# EAGLE design arduino_pro_mini (EAGLE 8.3.1)
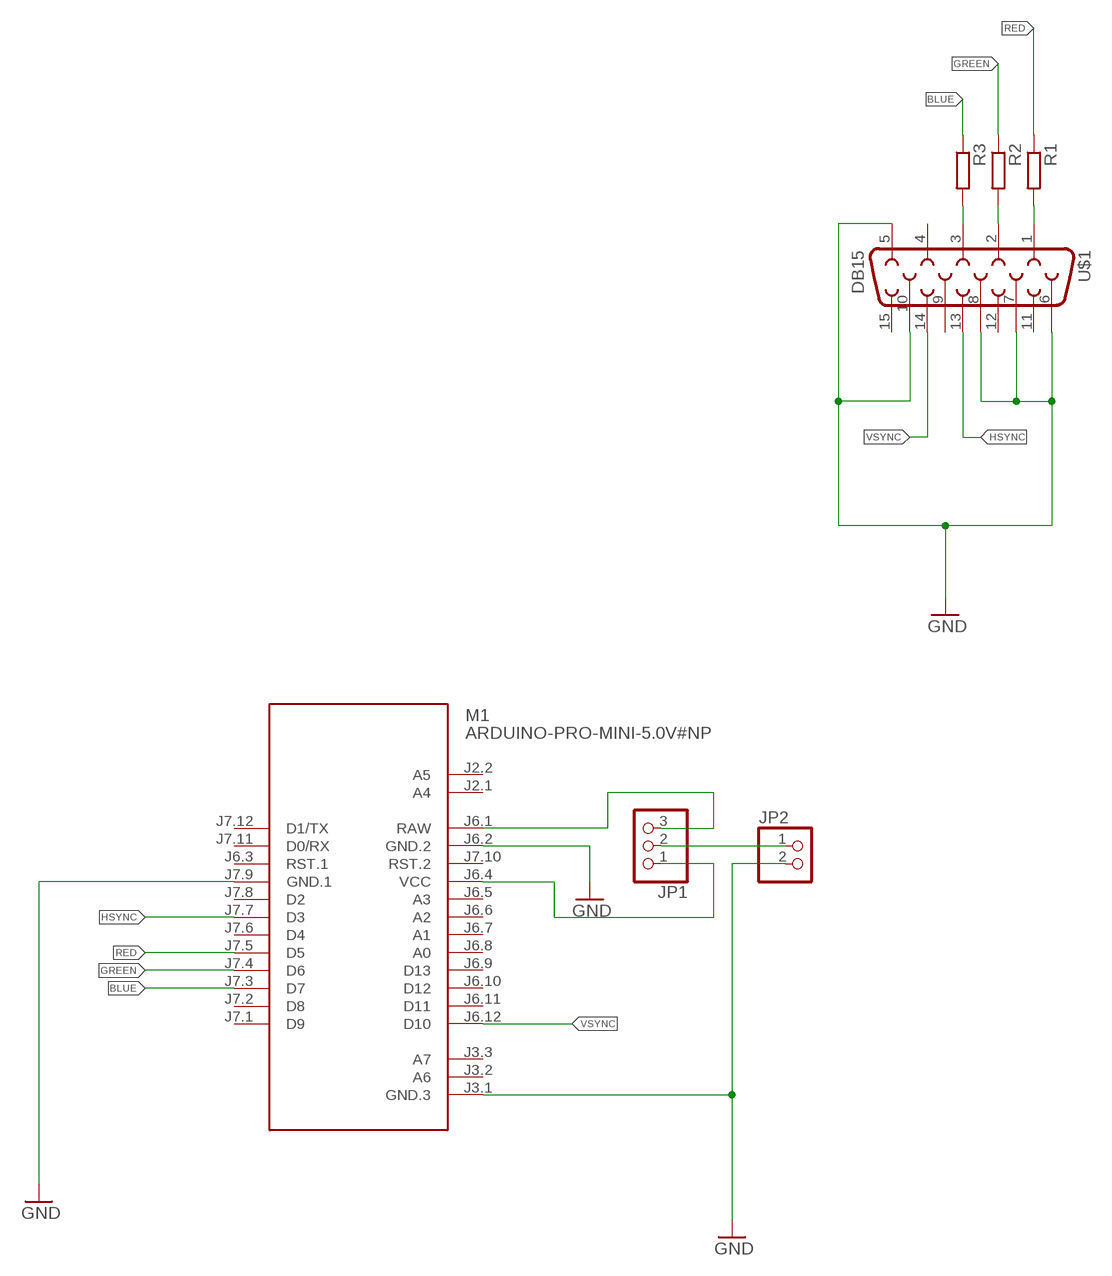
[diagram p0: schematic, sheet 1]

## Parts
JP1  PINHD-1X3/90  [1X03/90]
JP2  PINHD-1X2  [1X02]
M1  ARDUINO-PRO-MINI-5.0V#NP  [ARDUINO-PRO-MINI#NP]
R1  R-EU_0207/10  [0207/10]
R2  R-EU_0207/10  [0207/10]
R3  R-EU_0207/10  [0207/10]
U$1  DB15  [DB15]

## Nets
BLUE: M1.J7.3(D7) R3.1
GND: JP2.2 M1.J3.1(GND.3) M1.J6.2(GND.2) M1.J7.9(GND.1) U$1.5 U$1.6 U$1.7 U$1.8 U$1.10
GREEN: M1.J7.4(D6) R2.1
HSYNC: M1.J7.7(D3) U$1.13
N$1: JP1.1 M1.J6.4(VCC)
N$2: JP1.3 M1.J6.1(RAW)
N$3: JP1.2 JP2.1
N$4: R3.2 U$1.3
N$5: R2.2 U$1.2
N$6: R1.2 U$1.1
RED: M1.J7.5(D5) R1.1
VSYNC: M1.J6.12(D10) U$1.14
Unconnected: M1.J2.1(A4) M1.J2.2(A5) M1.J3.2(A6) M1.J3.3(A7) M1.J6.3(RST.1) M1.J6.5(A3) M1.J6.6(A2) M1.J6.7(A1) M1.J6.8(A0) M1.J6.9(D13) M1.J6.10(D12) M1.J6.11(D11) M1.J7.1(D9) M1.J7.2(D8) M1.J7.6(D4) M1.J7.8(D2) M1.J7.10(RST.2) M1.J7.11(D0/RX) M1.J7.12(D1/TX) U$1.4 U$1.9 U$1.11 U$1.12 U$1.15

## Library data of the parts
JP1 = pinhead:PINHD-1X3: PIN HEADER
JP2 = pinhead:PINHD-1X2: PIN HEADER
M1 = diy-modules:ARDUINO-PRO-MINI-*#NP: Arduino Pro Mini without programming pads
R1-R3 = resistor:R-EU_: RESISTOR, European symbol
U$1 = SparkFun-Connectors:DB15: DB15 / VGA right angle through-hole female connector.

## Net classes
0 default: width 0.406 mm

## Board
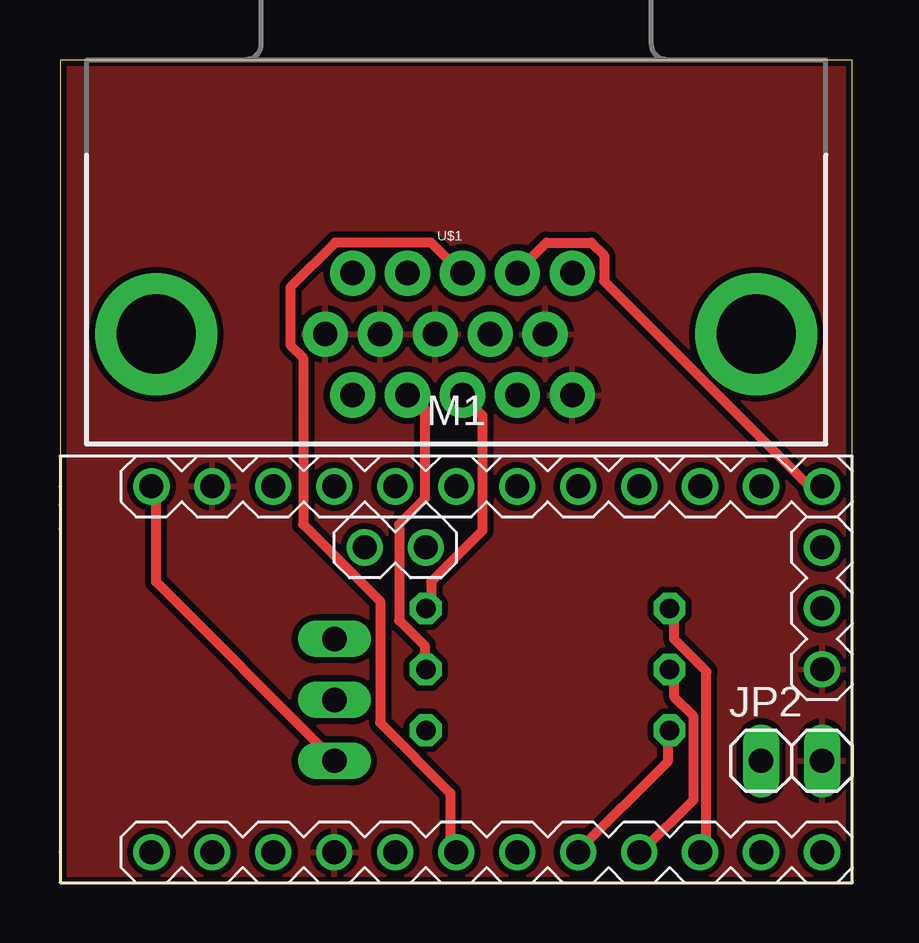
[diagram p1: board, top side]
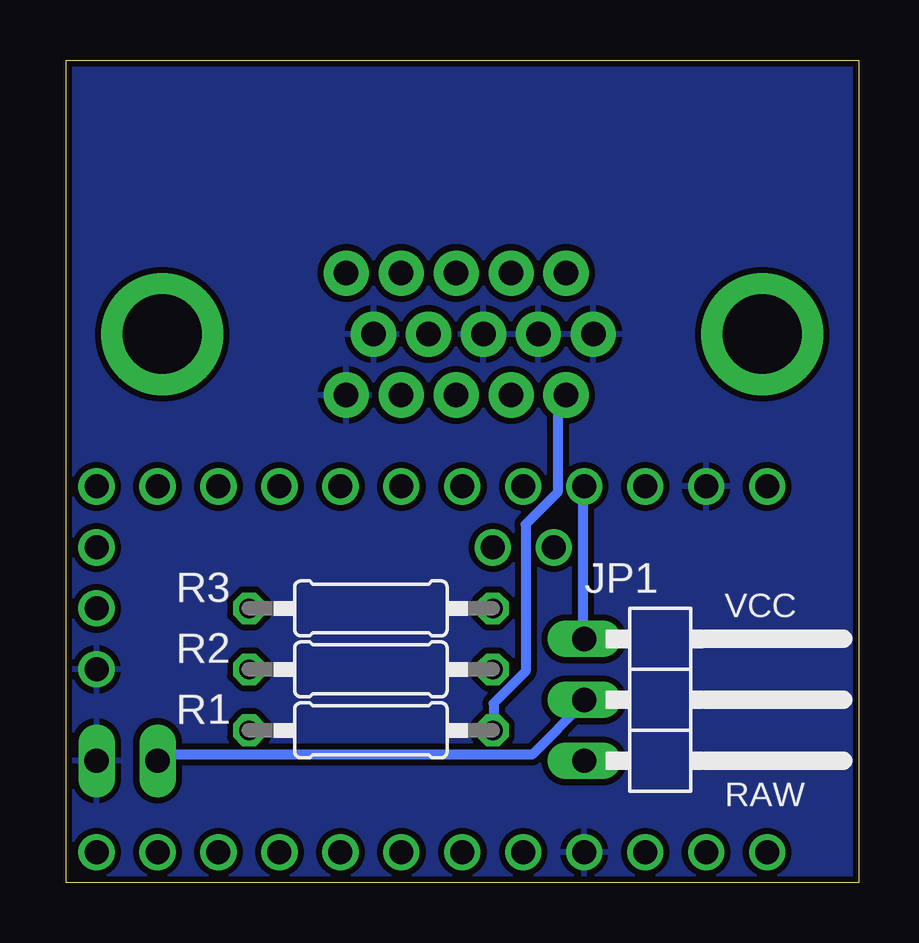
[diagram p2: board, bottom side, seen from below]

Size 33.02 x 34.28 mm. Coordinates in mm from the lower left corner, seen from the top.
Outline: 0,0 33.02,0 33.02,34.28 0,34.28 0,0
Copper layers (1*16): Top 0.035mm / dielectric 1.5mm / Bottom 0.035mm
Design rules "dirt_cheap_dirty_boards.v1": minimum track width 5mil, minimum drill 12mil, track to track 5mil, track to pad 5mil, pad to pad 5mil, via to via 5mil, smd to smd 0mil, copper to edge 10mil, drill to drill 10mil, minimum pad ring 10mil, minimum via ring 6mil, stop-mask expansion 2mil, vias tented up to drill 25mil, thermal gap 10mil

### Footprints (pad centres in the part's own frame; a part is rotated, then mirrored left to right if it is on the bottom)
1X03/90 = drill 1.016 long: 1 -2.54,-3.81; 2 0,-3.81; 3 2.54,-3.81
1X02 = drill 1.016 long: 1 -1.27,0; 2 1.27,0
ARDUINO-PRO-MINI#NP = drill 1: J2.1 -1.27,5.08; J2.2 -3.81,5.08; J3.1 15.24,0; J3.2 15.24,2.54; J3.3 15.24,5.08; J6.1 -12.7,7.62; J6.2 -10.16,7.62; J6.3 -7.62,7.62; J6.4 -5.08,7.62; J6.5 -2.54,7.62; J6.6 0,7.62; J6.7 2.54,7.62; J6.8 5.08,7.62; J6.9 7.62,7.62; J6.10 10.16,7.62; J6.11 12.7,7.62; J6.12 15.24,7.62; J7.1 15.24,-7.62; J7.2 12.7,-7.62; J7.3 10.16,-7.62; J7.4 7.62,-7.62; J7.5 5.08,-7.62; J7.6 2.54,-7.62; J7.7 0,-7.62; J7.8 -2.54,-7.62; J7.9 -5.08,-7.62; J7.10 -7.62,-7.62; J7.11 -10.16,-7.62; J7.12 -12.7,-7.62
0207/10 = drill 0.813 octagon: 1 -5.08,0; 2 5.08,0
DB15 = drill 1.016 pad 1.88: 1 -4.32,-7.62; 2 -2.03,-7.62; 3 0.26,-7.62; 4 2.55,-7.62; 5 4.84,-7.62; 6 -5.46,-5.08; 7 -3.17,-5.08; 8 -0.88,-5.08; 9 1.41,-5.08; 10 3.7,-5.08; 11 -4.32,-2.54; 12 -2.03,-2.54; 13 0.26,-2.54; 14 2.55,-2.54; 15 4.84,-2.54 | drill 3.302 pad 5.08: G1 -12.5,-5.08; G2 12.5,-5.08

### Placement (x,y rotation side)
JP1  7.62,7.62 270 bottom
JP2  30.48,5.08 0 top
M1  16.51,8.89 0 top
R1  20.32,6.35 0 bottom
R2  20.32,8.89 0 bottom
R3  20.32,11.43 0 bottom
U$1  16.51,27.94 0 top

### Tracks (layer width: path | path; a pad name or v marks a point on that pad's centre or on a via)
BLUE
  Top 0.406: R3.1 25.6,11.2 25.6,10.13 26.94,8.8 26.94,1.6 26.67,1.33 M1.J7.3
GND
  pour Top (isolate 0.254): -1.27,36.83 36.83,36.83 36.83,-3.81 -1.27,-3.81
  pour Bottom (isolate 0.254): -3.81,36.83 34.29,36.83 34.29,-3.81 -3.81,-3.81
GREEN
  Top 0.406: R2.1 25.6,8.8 25.6,7.73 26.4,6.93 26.4,3.47 24.27,1.33 M1.J7.4
HSYNC
  Top 0.406: M1.J7.7 16.27,1.33 16.27,3.73 13.34,6.67 13.34,11.73 10.13,14.94 10.13,21.87 9.6,22.4 9.6,24.8 11.47,26.67 15.47,26.67 16.54,25.6 U$1.13
N$1
  Bottom 0.406: M1.J6.4 11.47,16.27 11.47,10.4 JP1.1
N$2
  Top 0.406: M1.J6.1 4,16.27 4,12.54 11.2,5.33 JP1.3
N$3
  Bottom 0.406: JP2.1 29.07,5.33 13.6,5.33 11.47,7.47 JP1.2
N$4
  Top 0.406: R3.2 15.47,11.47 15.47,12.54 17.6,14.67 17.6,19.47 16.8,20.27 U$1.3
N$5
  Top 0.406: R2.2 15.2,9.07 15.2,9.87 14.13,10.94 14.13,14.94 15.2,16 15.2,19.74 14.67,20.27 U$1.2
N$6
  Bottom 0.406: R1.2 15.2,6.4 15.2,7.47 13.87,8.8 13.87,14.94 12.54,16.27 12.54,20 12.27,20.27 U$1.1
RED
  Top 0.406: R1.1 25.34,6.13 25.34,5.07 21.6,1.33 M1.J7.5
VSYNC
  Top 0.406: M1.J6.12 31.74,16.54 31.2,16.54 22.67,25.07 22.67,26.14 22.14,26.67 20.27,26.67 19.2,25.6 U$1.14

### Text on the board
bPlace: VCC | RAW